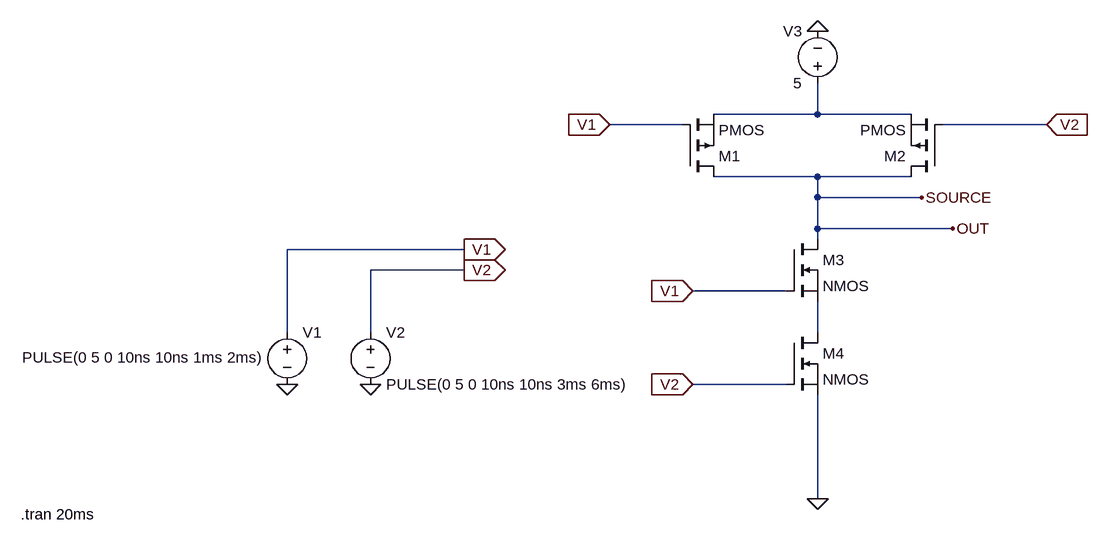
[diagram p0: schematic NAND.asc]
NAND.asc, the LTspice schematic file:
Version 4
SHEET 1 1080 680
WIRE 640 -240 640 -288
WIRE 640 -240 480 -240
WIRE 784 -240 640 -240
WIRE 432 -224 320 -224
WIRE 992 -224 832 -224
WIRE 640 -144 480 -144
WIRE 784 -144 640 -144
WIRE 640 -112 640 -144
WIRE 800 -112 640 -112
WIRE 640 -64 640 -112
WIRE 848 -64 640 -64
WIRE 640 -48 640 -64
WIRE 96 -32 -176 -32
WIRE 96 0 -48 0
WIRE 592 32 448 32
WIRE -176 96 -176 -32
WIRE -48 96 -48 0
WIRE 640 96 640 48
WIRE 592 176 448 176
WIRE 640 352 640 192
FLAG 640 -368 0
FLAG -176 176 0
FLAG -48 176 0
FLAG 96 -32 V1
IOPIN 96 -32 Out
FLAG 96 0 V2
IOPIN 96 0 Out
FLAG 800 -112 SOURCE
FLAG 848 -64 OUT
FLAG 640 352 0
FLAG 320 -224 V1
IOPIN 320 -224 In
FLAG 992 -224 V2
IOPIN 992 -224 In
FLAG 448 32 V1
IOPIN 448 32 In
FLAG 448 176 V2
IOPIN 448 176 In
SYMBOL voltage -176 80 R0
WINDOW 3 -408 54 Left 2
WINDOW 123 0 0 Left 0
WINDOW 39 0 0 Left 0
SYMATTR InstName V1
SYMATTR Value PULSE(0 5 0 10ns 10ns 1ms 2ms)
SYMBOL voltage -48 80 R0
WINDOW 123 0 0 Left 0
WINDOW 39 0 0 Left 0
SYMATTR InstName V2
SYMATTR Value PULSE(0 5 0 10ns 10ns 3ms 6ms)
SYMBOL voltage 640 -272 R180
WINDOW 0 24 96 Left 2
WINDOW 3 24 16 Left 2
WINDOW 123 0 0 Left 0
WINDOW 39 0 0 Left 0
SYMATTR InstName V3
SYMATTR Value 5
SYMBOL pmos 432 -144 M180
SYMATTR InstName M1
SYMBOL pmos 832 -144 R180
SYMATTR InstName M2
SYMBOL nmos 592 -48 R0
SYMATTR InstName M3
SYMBOL nmos 592 96 R0
SYMATTR InstName M4
TEXT -586 376 Left 2 !.tran 20ms

The netlist it stands for:
* NAND.asc
V1 V1 0 PULSE(0 5 0 10ns 10ns 1ms 2ms)
V2 V2 0 PULSE(0 5 0 10ns 10ns 3ms 6ms)
V3 N001 0 5
M1 OUT V1 N001 N001 PMOS
M2 OUT V2 N001 N001 PMOS
M3 OUT V1 N002 N002 NMOS
M4 N002 V2 0 0 NMOS
.model NMOS NMOS
.model PMOS PMOS
.lib standard.mos
.tran 20ms
.backanno
.end